# Altium project Power.PrjPcb
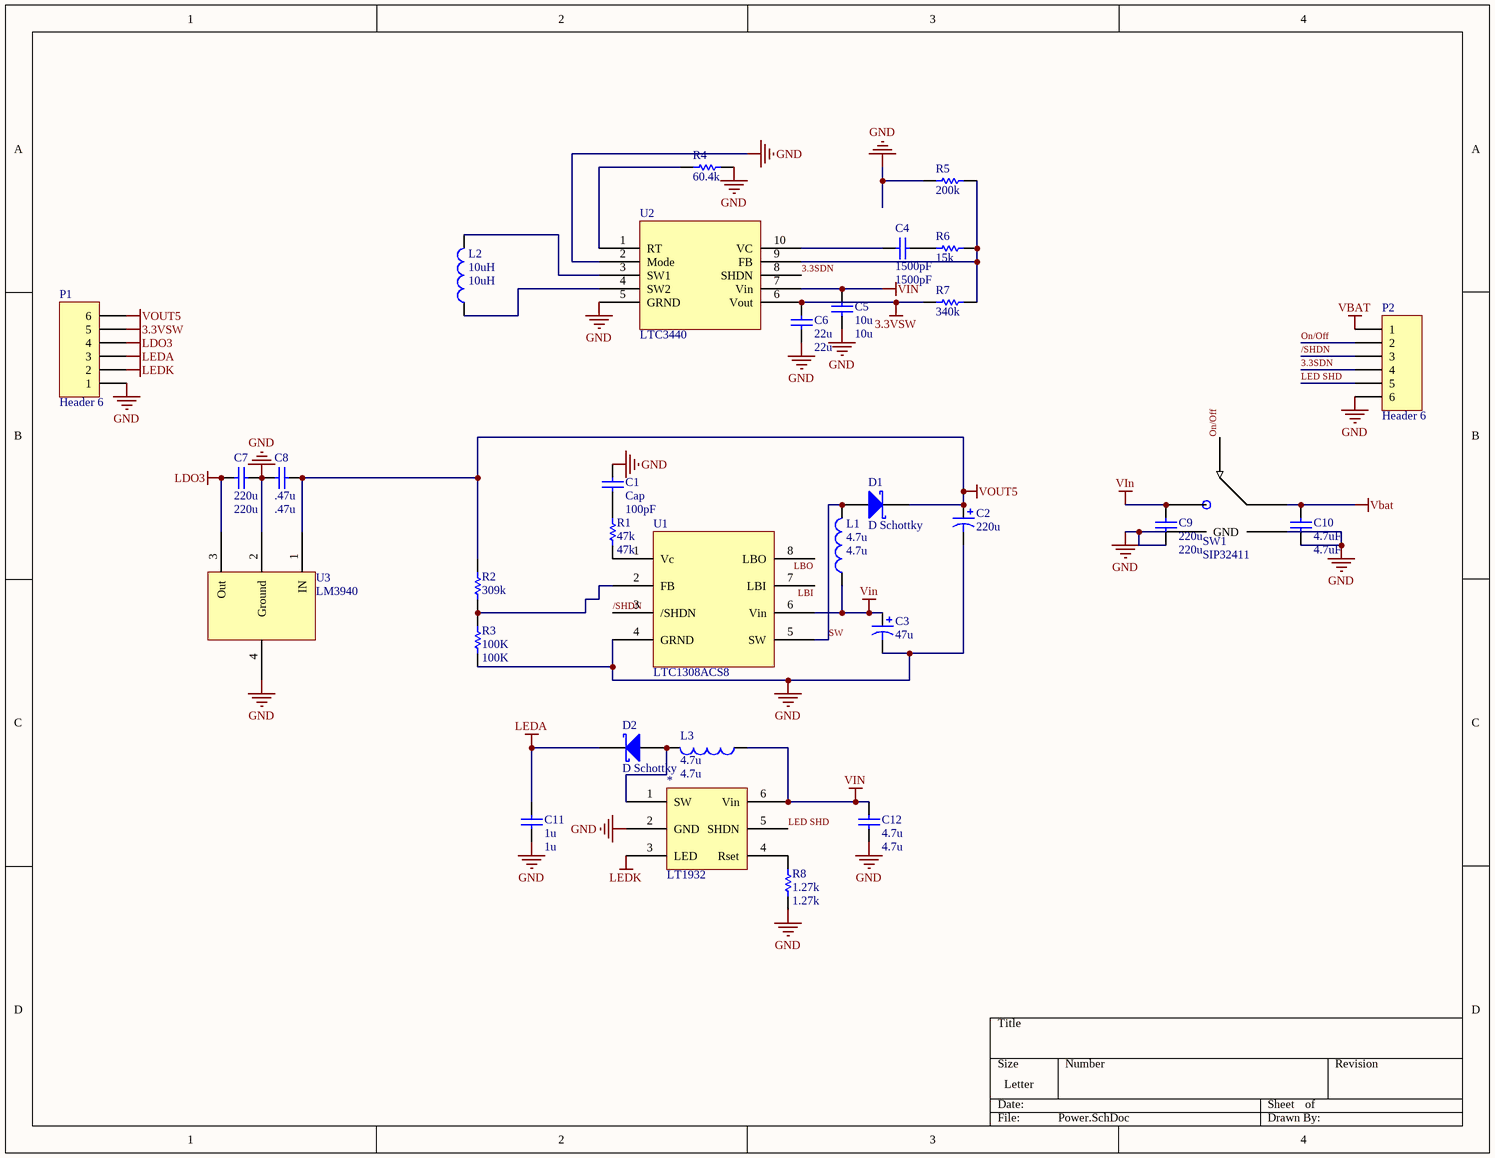
[diagram p0: Power.SchDoc]
1 sheet, 32 parts. Net scope: global (net labels, ports and power ports of the same name join across sheets).
Board file: Power.PcbDoc

## Sheet Power.SchDoc
size Letter

### Parts
*  LT1932  [SOT6]
C1  Cap  value 100pF  [C0805]
C2  220u  [C2917]
C3  47u  [C2312]
C4  1500pF  [C0805]
C5  10u  [C0805]
C6  22u  [C1210]
C7  220u  [C2917]
C8  .47u  [C0805]
C9  220u  [C2917]
C10  4.7uF  [C0805]
C11  1u  [C1206]
C12  4.7u  [C0805]
D1  D Schottky  [ShottkeyDiode]
D2  D Schottky  [ZHCSDiode]
L1  4.7u  [Inductor]
L2  10uH  [10uH Inductor]
L3  4.7u  [Inductor]
P1  Header 6  [HDR1X6]
P2  Header 6  [HDR1X6]
R1  47k  [6-0805_M]
R2  309k  [6-0805_M]
R3  100K  [6-0805_M]
R4  60.4k  [6-0805_M]
R5  200k  [6-0805_M]
R6  15k  [6-0805_M]
R7  340k  [6-0805_M]
R8  1.27k  [6-0805_M]
SW1  SIP32411  [SOT6 - duplicate]
U1  LTC1308ACS8  [SOP8_LTC1308A]
U2  LTC3440  [MS10]
U3  LM3940  [LDO]

### Nets
3.3VSW: C6.2 P1.5 R7.2 U2.6(Vout)
GND: *.2(GND) C1.1 C2.2 C3.2 C5.1 C6.1 C7.2 C8.1 C9.1 C10.1 C11.1 C12.1 P1.1 P2.6 R3.2 R4.2 R5.1 R8.1 SW1.2(GND) SW1.5(GND) U1.4(GRND) U2.2(Mode) U2.5(GRND) U3.2(Ground) U3.4(Ground)
LDO3: C7.1 P1.4 U3.3(Out)
LEDA: C11.2 D2.2(K) P1.3
LEDK: *.3(LED) P1.2
Vbat: C10.2 P2.1 SW1.4(In)
Vin: *.6(Vin) C3.1 C5.2 C9.2 C12.2 L1.1 L3.1 SW1.1(Out) U1.6(Vin) U2.7(Vin)
VOUT5: C2.1 C8.2 D1.K P1.6 R2.1 U3.1(IN)
3.3SDN: P2.4 U2.8(SHDN)
/SHDN: P2.3 U1.3(/SHDN)
LBI: U1.7(LBI)
LBO: U1.8(LBO)
LED SHD: *.5(SHDN) P2.5
On/Off: P2.2 SW1.3
SW: D1.A L1.2 U1.5(SW)
Net*_1: *.1(SW) D2.1(A) L3.2
Net*_4: *.4(Rset) R8.2
NetC1_2: C1.2 R1.2
NetC4_1: C4.1 U2.10(VC)
NetC4_2: C4.2 R6.1
NetL2_1: L2.1 U2.4(SW2)
NetL2_2: L2.2 U2.3(SW1)
NetR1_1: R1.1 U1.1(Vc)
NetR2_2: R2.2 R3.1 U1.2(FB)
NetR4_1: R4.1 U2.1(RT)
NetR5_2: R5.2 R6.2 R7.1 U2.9(FB)

### Library data of the parts
C1 C4-C12 = Cap: Capacitor; Published: 8-Jun-2000; LatestRevisionDate: 17-Jul-2002; LatestRevisionNote: Re-released for DXP Platform.; PackageReference: RAD-0.3; Publisher: Altium Limited; PackageDescription: Radial Cap, Thru-Hole; 2 Leads; 0.3 in Pin Spacing
  C4: Value: 1500pF
  C5: Value: 10u
  C6: Value: 22u
  C7 C9: Value: 220u
  C8: Value: .47u
  C10: Value: 4.7uF
  C11: Value: 1u
  C12: Value: 4.7u
C2 C3 = Cap Pol1: Polarized Capacitor (Radial); Published: 8-Jun-2000; LatestRevisionDate: 17-Jul-2002; LatestRevisionNote: Re-released for DXP Platform.; PackageReference: RB7.6-15; Publisher: Altium Limited; PackageDescription: Polarized Capacitor (Radial); 2 Leads
  C2: Value: 220u
  C3: Value: 47u
D1 = D Schottky: Schottky Diode; Published: 8-Jun-2000; LatestRevisionDate: 17-Jul-2002; LatestRevisionNote: Re-released for DXP Platform.; PackageReference: SMB; Publisher: Altium Limited; PackageDescription: DO-214-AA/SMB; 2 C-Bend Leads; Body 5.3 x 3.6 mm, inc. leads (LxW); Code_JEDEC: DO-214-AA
D2 = D Schottky: Schottky Diode; pin to pad: 1>A 2>K; Published: 8-Jun-2000; LatestRevisionDate: 17-Jul-2002; LatestRevisionNote: Re-released for DXP Platform.; PackageReference: SMB; Publisher: Altium Limited; PackageDescription: DO-214-AA/SMB; 2 C-Bend Leads; Body 5.3 x 3.6 mm, inc. leads (LxW); Code_JEDEC: DO-214-AA
L1-L3 = Inductor: Code_IEC: 1005; Published: 8-Jun-2000; LatestRevisionDate: 29-May-2009; LatestRevisionNote: IPC-7351 Footprint Added.; PackageReference: 0402-A; Publisher: Altium Limited; PackageDescription: Chip Inductor; Code_JEITA: 0402
  L1 L3: Value: 4.7u
  L2: Value: 10uH
P1 P2 = Header 6: Header, 6-Pin; LatestRevisionDate: 17-Jul-2002; LatestRevisionNote: Re-released for DXP Platform.; Publisher: Altium Limited
R1-R8 = Res1: Resistor; Published: 8-Jun-2000; LatestRevisionDate: 17-Jul-2002; LatestRevisionNote: Re-released for DXP Platform.; PackageReference: AXIAL-0.3; Publisher: Altium Limited; PackageDescription: Axial Device, Thru-Hole; 2 Leads; 0.3 in Pin Spacing
  R1: Value: 47k
  R2: Value: 309k
  R3: Value: 100K
  R4: Value: 60.4k
  R5: Value: 200k
  R6: Value: 15k
  R7: Value: 340k
  R8: Value: 1.27k